# Altium schematic sheet power.SchDoc
size A3
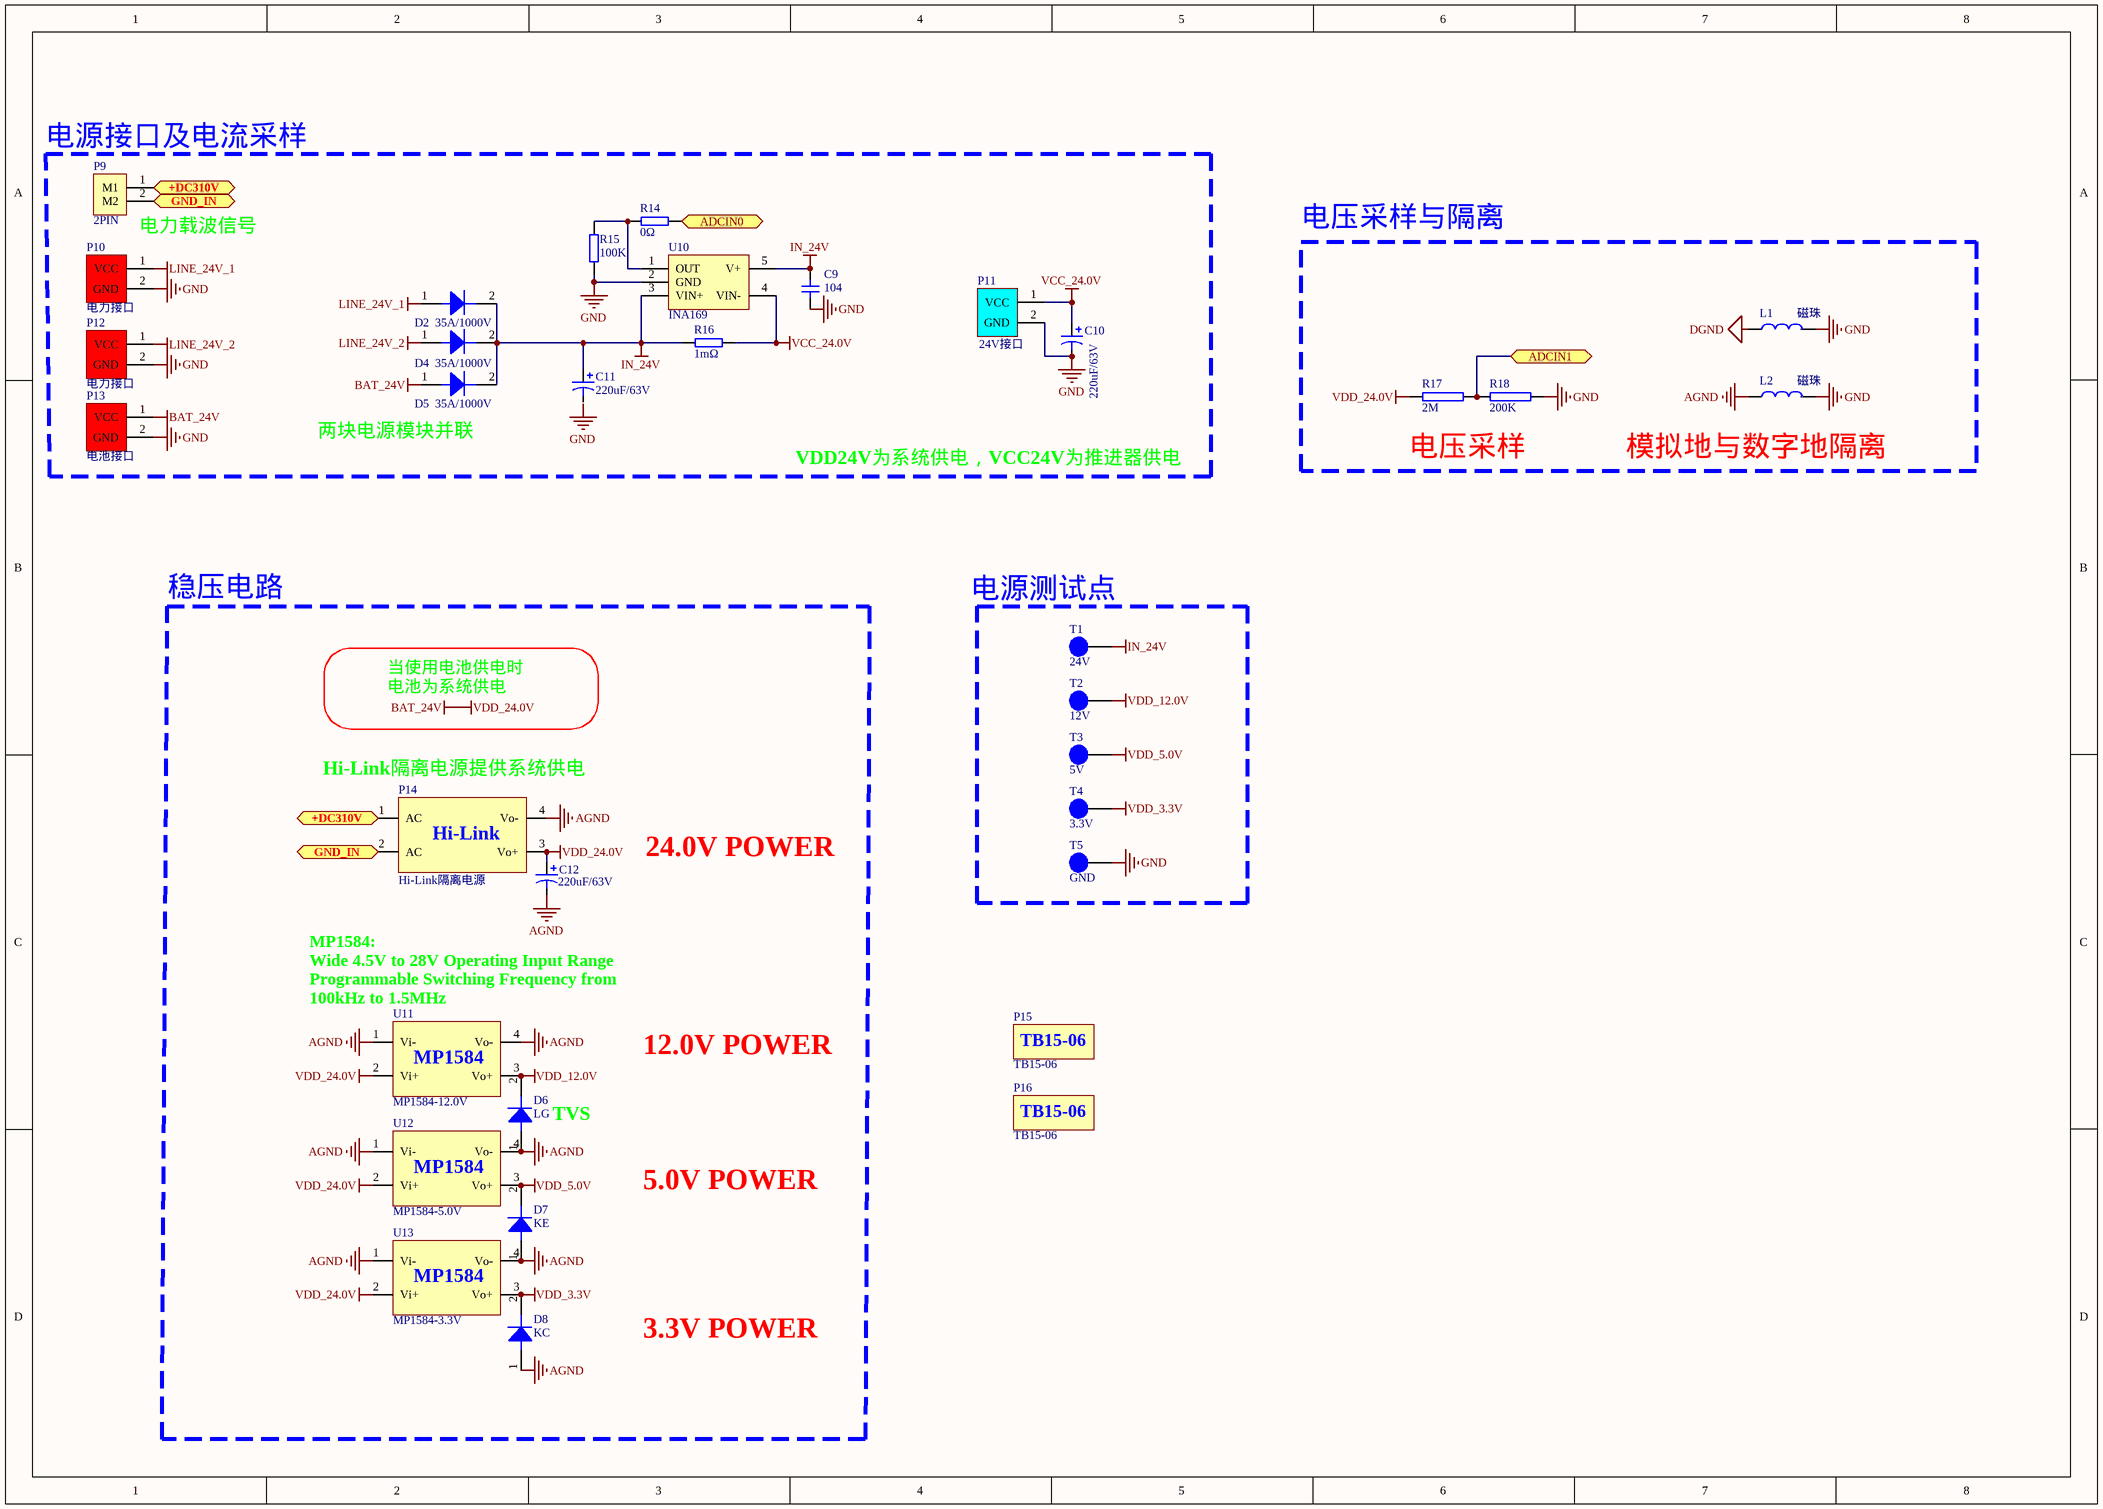
[diagram p0: power.SchDoc]

## Parts
C9  104  [0805C]
C10  220uF/63V  [RB.2.4]
C11  220uF/63V  [RB.2.4]
C12  220uF/63V  [RB.2.4]
D2  35A/1000V  [R-6]
D4  35A/1000V  [R-6]
D5  35A/1000V  [R-6]
D6  LG  [SMA]
D7  KE  [SMA]
D8  KC  [SMA]
L1  磁珠  [1206L]
L2  磁珠  [1206L]
P9  2PIN  [PH2.0WS-2P]
P10  电力接口  [XT60-F]
P11  24V接口  [XT60-F]
P12  电力接口  [XT60-F]
P13  电池接口  [XT60-F]
P14  Hi-Link隔离电源  [HLK-20M24]
P15  TB15-06  [TB1506]
P16  TB15-06  [TB1506]
R14  0Ω  [0805R]
R15  100K  [0805R]
R16  1mΩ  [2512R]
R17  2M  [0805R]
R18  200K  [0805R]
T1  24V  [HEADER 1]
T2  12V  [HEADER 1]
T3  5V  [HEADER 1]
T4  3.3V  [HEADER 1]
T5  GND  [HEADER 1]
U10  INA169  [SOT23-5]
U11  MP1584-12.0V  [MP1584电源模块]
U12  MP1584-5.0V  [MP1584电源模块]
U13  MP1584-3.3V  [MP1584电源模块]

## Blocks framed on the sheet
电源接口及电流采样: C9-C11 D2 D4 D5 P9-P13 R14-R16 U10

## Ports
+DC310V, ADCIN0, ADCIN1, GND_IN

## Nets
AGND: C12.2 D6.1 D7.1 D8.1 L2.1 P14.4(Vo-) U11.1(Vi-) U11.4(Vo-) U12.1(Vi-) U12.4(Vo-) U13.1(Vi-) U13.4(Vo-)
BAT_24V: C12.1 D5.1 P13.1(VCC) P14.3(Vo+) R17.1 U11.2(Vi+) U12.2(Vi+) U13.2(Vi+)  [also labelled VDD_24.0V]
DGND: L1.1
GND: C9.1 C10.2 L1.2 L2.2 P10.2(GND) P11.2(GND) P12.2(GND) P13.2(GND) R15.1 R18.2 T5.1 U10.2(GND)
IN_24V: C9.2 C11.1 D2.2 D4.2 D5.2 R16.2 T1.1 U10.3(VIN+) U10.5(V+)
LINE_24V_1: D2.1 P10.1(VCC)
LINE_24V_2: D4.1 P12.1(VCC)
VCC_24.0V: C10.1 P11.1(VCC) R16.1 U10.4(VIN-)
VDD_3.3V: D8.2 T4.1 U13.3(Vo+)
VDD_5.0V: D7.2 T3.1 U12.3(Vo+)
VDD_12.0V: D6.2 T2.1 U11.3(Vo+)
+DC310V: P9.1(M1) P14.1(AC) ; port +DC310V
ADCIN0: R14.1 ; port ADCIN0
ADCIN1: R17.2 R18.1 ; port ADCIN1
GND_IN: P9.2(M2) P14.2(AC) ; port GND_IN
NetR14_2: R14.2 R15.2 U10.1(OUT)

Not connected (* = marked no-connect by the designer): C11 2

## Notes on the sheet
- (near P9) 电力载波信号
- 电压采样与隔离
- 两块电源模块并联
- VDD24V为系统供电，VCC24V为推进器供电
- 电压采样
- (near L2) 模拟地与数字地隔离
- 稳压电路
- 电源测试点
- 当使用电池供电时
  电池为系统供电
- (near P14) Hi-Link隔离电源提供系统供电
- 24.0V POWER
- MP1584:
  Wide 4.5V to 28V Operating Input Range
  Programmable Switching Frequency from
  100kHz to 1.5MHz
- 12.0V POWER
- (near D6) TVS
- 5.0V POWER
- 3.3V POWER
- Labels drawn without touching a wire or pin: GND
- (in symbol HILINK-24V) Hi-Link
- (in symbol MP1584电源模块) MP1584

## Library data of the parts
C9 = Cap1: 无极贴片电容
C10-C12 = Cap3: 直插极性电容
D2 D4-D8 = Diode: 二极管
L1 L2 = L: 电感
P9 = 接线端子-2PIN
P10 P12 P13 = 电源端子
P11 = 推进器电源
P14 = HILINK-24V
R14-R16 = Res: 电阻
R17 R18 = R1
T1-T5 = 测试点
U11-U13 = MP1584电源模块